# Altium schematic sheet LPF.SchDoc
size A0
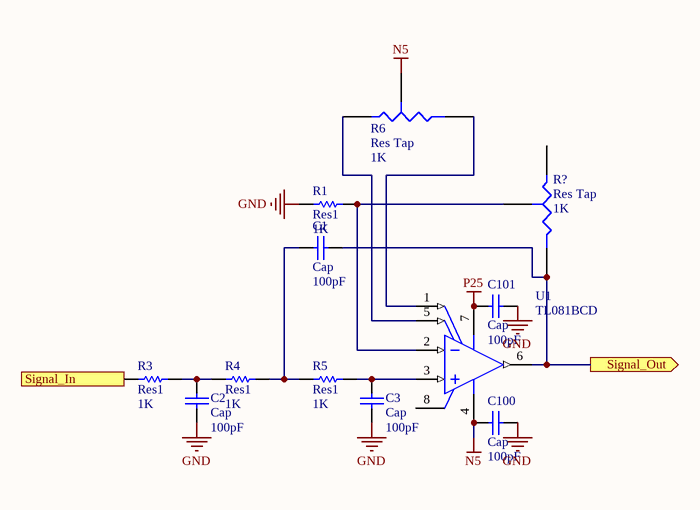
[diagram p0: LPF.SchDoc]

## Parts
C1  Cap  value 100pF  [CAPC1608N]
C2  Cap  value 100pF  [CAPC1608N]
C3  Cap  value 100pF  [CAPC1608N]
C100  Cap  value 100pF  [CAPC1608N]
C101  Cap  value 100pF  [CAPC1608N]
R1  Res1  value 1K  [RESC1608N]
R3  Res1  value 1K  [RESC1608N]
R4  Res1  value 1K  [RESC1608N]
R5  Res1  value 1K  [RESC1608N]
R6  Res Tap  value 1K  [HDR1X3]
R?  Res Tap  value 1K  [HDR1X3]
U1  TL081BCD  [TI-D8_N]

## Ports
Signal_In (in), Signal_Out (out)

## Nets
GND: C2.1 C3.1 C100.1 C101.1 R1.1
N5: C100.2 R6.3(TAP) U1.4(VCC-)
P25: C101.2 U1.7(VCC+)
Signal_In: R3.1 ; port Signal_In
Signal_Out: C1.1 R?.2(B) U1.6(OUT) ; port Signal_Out
NetC1_2: C1.2 R4.2 R5.1
NetC2_2: C2.2 R3.2 R4.1
NetC3_2: C3.2 R5.2 U1.3(IN+)
NetR1_2: R1.2 R?.3(TAP) U1.2(IN-)
NetR6_1: R6.1(A) U1.5(OFFSET_N2)
NetR6_2: R6.2(B) U1.1(OFFSET_N1)

Not connected (* = marked no-connect by the designer): R? 1(A); U1 8(NC)

## Library data of the parts
C1-C3 C100 C101 = Cap: Capacitor; Published: 8-Jun-2000; LatestRevisionDate: 17-Jul-2002; LatestRevisionNote: Re-released for DXP Platform.; PackageReference: RAD-0.3; Publisher: Altium Limited; PackageDescription: Radial Cap, Thru-Hole; 2 Leads; 0.3 in Pin Spacing
R1 R3-R5 = Res1: Resistor; Published: 8-Jun-2000; LatestRevisionDate: 17-Jul-2002; LatestRevisionNote: Re-released for DXP Platform.; PackageReference: AXIAL-0.3; Publisher: Altium Limited; PackageDescription: Axial Device, Thru-Hole; 2 Leads; 0.3 in Pin Spacing
R6 R? = Res Tap: Tapped Resistor; pin to pad: 2>3 3>2; Sim Note: Enter the Resistance value and the set point into parameter fields.; Set Position: 0.5; Published: 24-Mar-1999; LatestRevisionDate: 17-Jul-2002; LatestRevisionNote: Re-released for DXP Platform.; PackageReference: VR3; Publisher: Altium Limited; PackageDescription: Variable Resistor, Thru-Hole; 3 Leads
U1 = TL081BCD: JFET-Input Operational Amplifier, 7 to 36 V, 0 to 70 degC, 8-pin SOIC (D8), Green (RoHS & no Sb/Br); Manufacturer: Texas Instruments; CMRR(Min)(dB): 75; GBW(Typ)(MHz): 3; IIB(Max)(pA): 200; Iq per channel(Max)(mA): 2.8; Number of Channels: 1; Offset Drift(Typ)(uV/C): 18; Rating: Catalog; Slew Rate(Typ)(V/us): 13; Sub Family: General Purpose Amplifier, High Supply Voltage Amplifier (>=30V); Total Supply Voltage(Max)(+5V is 5, +/-5V is 10): 36; Total Supply Voltage(Min)(+5V is 5, +/-5V is 10): 7; DatasheetVersion: SLOS081G; PackageVersion: 4040047-3/M, 06/2011; PackageReference: D8; PackageDescription: 8-Pin Plastic Small Outline, Body 4.9 x 3.9 mm, Pitch 1.27 mm; Supplier 1: Digi-Key; Supplier Part Number 1: 296-34259-5-ND; Supplier 2: Farnell; Supplier Part Number 2: 1459710; Supplier 3: Newark; Supplier Part Number 3: 62M0593; Supplier 4: Newark; Supplier Part Number 4: 76C9117; Supplier 5: Mouser; Supplier Part Number 5: 595-TL081BCD; Eco-Plan: Green (RoHS & no Sb/Br); Vio (25C)(Max)(mV): 3; Vn at 1kHz(Typ)(nV/rtHz): 18; Mounting Technology: Surface Mount; Code_JEDEC: MS-012; PartNumber: TL081BCD; ComponentLink1Description: Manufacturer URL; ComponentLink1URL: http://www.ti.com/; ComponentLink2Description: Datasheet; ComponentLink2URL: http://www.ti.com/lit/ds/symlink/tl081b.pdf; ComponentLink3Description: Package Specification; ComponentLink3URL: http://www.ti.com/litv/pdf/msoi002j